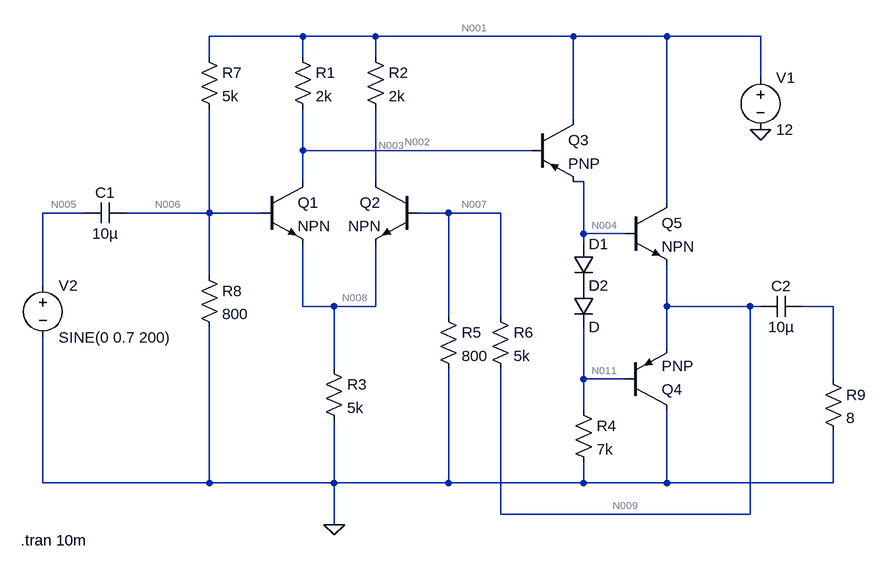
[diagram p0: schematic Last try.asc]
Last try.asc, the LTspice schematic file:
Version 4
SHEET 1 1032 680
WIRE 160 -112 16 -112
WIRE 272 -112 160 -112
WIRE 576 -112 272 -112
WIRE 720 -112 576 -112
WIRE 864 -112 720 -112
WIRE 16 -80 16 -112
WIRE 160 -80 160 -112
WIRE 272 -80 272 -112
WIRE 864 -48 864 -112
WIRE 576 16 576 -112
WIRE 160 64 160 0
WIRE 512 64 160 64
WIRE 160 112 160 64
WIRE 272 112 272 0
WIRE 592 112 576 112
WIRE 720 144 720 -112
WIRE -176 160 -240 160
WIRE 16 160 16 0
WIRE 16 160 -112 160
WIRE 96 160 16 160
WIRE 384 160 336 160
WIRE 464 160 384 160
WIRE 592 192 592 112
WIRE 656 192 592 192
WIRE 592 208 592 192
WIRE 16 256 16 160
WIRE -240 272 -240 160
WIRE 160 304 160 208
WIRE 208 304 160 304
WIRE 272 304 272 208
WIRE 272 304 208 304
WIRE 720 304 720 240
WIRE 848 304 720 304
WIRE 864 304 848 304
WIRE 976 304 928 304
WIRE 384 320 384 160
WIRE 464 320 464 160
WIRE 720 368 720 304
WIRE 208 400 208 304
WIRE 592 416 592 336
WIRE 656 416 592 416
WIRE 976 416 976 304
WIRE 592 464 592 416
WIRE -240 576 -240 352
WIRE 16 576 16 336
WIRE 16 576 -240 576
WIRE 208 576 208 480
WIRE 208 576 16 576
WIRE 384 576 384 400
WIRE 384 576 208 576
WIRE 592 576 592 544
WIRE 592 576 384 576
WIRE 720 576 720 464
WIRE 720 576 592 576
WIRE 976 576 976 496
WIRE 976 576 720 576
WIRE 464 624 464 400
WIRE 848 624 848 304
WIRE 848 624 464 624
WIRE 208 640 208 576
FLAG 208 640 0
FLAG 864 32 0
SYMBOL npn 336 112 M0
SYMATTR InstName Q2
SYMBOL pnp 512 16 R0
SYMATTR InstName Q3
SYMBOL pnp 656 464 M180
SYMATTR InstName Q4
SYMBOL npn 656 144 R0
SYMATTR InstName Q5
SYMBOL res 144 -96 R0
SYMATTR InstName R1
SYMATTR Value 2k
SYMBOL res 256 -96 R0
SYMATTR InstName R2
SYMATTR Value 2k
SYMBOL res 192 384 R0
SYMATTR InstName R3
SYMATTR Value 5k
SYMBOL diode 576 208 R0
SYMATTR InstName D1
SYMBOL diode 576 272 R0
SYMATTR InstName D2
SYMBOL res 576 448 R0
SYMATTR InstName R4
SYMATTR Value 7k
SYMBOL res 368 304 R0
SYMATTR InstName R5
SYMATTR Value 800
SYMBOL res 448 304 R0
SYMATTR InstName R6
SYMATTR Value 5k
SYMBOL res 0 -96 R0
SYMATTR InstName R7
SYMATTR Value 5k
SYMBOL res 0 240 R0
SYMATTR InstName R8
SYMATTR Value 800
SYMBOL cap -112 144 R90
WINDOW 0 0 32 VBottom 2
WINDOW 3 32 32 VTop 2
SYMATTR InstName C1
SYMATTR Value 10µ
SYMBOL cap 928 288 R90
WINDOW 0 0 32 VBottom 2
WINDOW 3 32 32 VTop 2
SYMATTR InstName C2
SYMATTR Value 10µ
SYMBOL voltage -240 256 R0
WINDOW 123 0 0 Left 0
WINDOW 39 0 0 Left 0
SYMATTR InstName V2
SYMATTR Value SINE(0 0.7 200)
SYMBOL res 960 400 R0
SYMATTR InstName R9
SYMATTR Value 8
SYMBOL voltage 864 -64 R0
WINDOW 123 0 0 Left 0
WINDOW 39 0 0 Left 0
SYMATTR InstName V1
SYMATTR Value 12
SYMBOL npn 96 112 R0
SYMATTR InstName Q1
TEXT -274 664 Left 2 !.tran 10m

The netlist it stands for:
* Last try.asc
Q2 N003 N007 N008 0 NPN
Q3 N001 N002 N004 0 PNP
Q4 0 N011 N009 0 PNP
Q5 N001 N004 N009 0 NPN
R1 N001 N002 2k
R2 N001 N003 2k
R3 N008 0 5k
D1 N004 P001 D
D2 P001 N011 D
R4 N011 0 7k
R5 N007 0 800
R6 N007 N009 5k
R7 N001 N006 5k
R8 N006 0 800
C1 N006 N005 10µ
C2 N010 N009 10µ
V2 N005 0 SINE(0 0.7 200)
R9 N010 0 8
V1 N001 0 12
Q1 N002 N006 N008 0 NPN
.model D D
.lib standard.dio
.model NPN NPN
.model PNP PNP
.lib standard.bjt
.tran 10m
.backanno
.end

* Results of the author's LTspice run, read from the files saved beside the schematic
* Operating Point, zero values left out:
*   V(n003) = 12 V
*   V(n007) = 6.019 µV
*   V(n008) = 923.6 mV
*   V(n001) = 12 V
*   V(n002) = 11.63 V
*   V(n004) = 468.8 mV
*   V(n011) = 605.7 nV
*   V(n009) = 43.57 µV
*   V(p001) = 234.4 mV
*   V(n006) = 1.654 V
*   Ic(Q3) = 277.7 pA
*   Ib(Q3) = -127.9 pA
*   Ie(Q3) = -149.8 pA
*   Ic(Q1) = 182.9 µA
*   Ib(Q1) = 1.829 µA
*   Ie(Q1) = -184.7 µA
*   Ic(Q5) = 7.447 nA
*   Ib(Q5) = 63.29 pA
*   Ie(Q5) = -7.51 nA
*   Ic(Q2) = 12 pA
*   Ib(Q2) = -12.92 pA
*   I(D2) = 86.52 pA
*   I(D1) = 86.52 pA
*   I(R8) = 2.067 mA
*   I(R7) = 2.069 mA
*   I(R6) = -7.51 nA
*   I(R5) = 7.523 nA
*   I(R4) = 86.52 pA
*   I(R3) = 184.7 µA
*   I(R2) = 12 pA
*   I(R1) = 182.9 µA
*   I(V1) = -2.252 mA
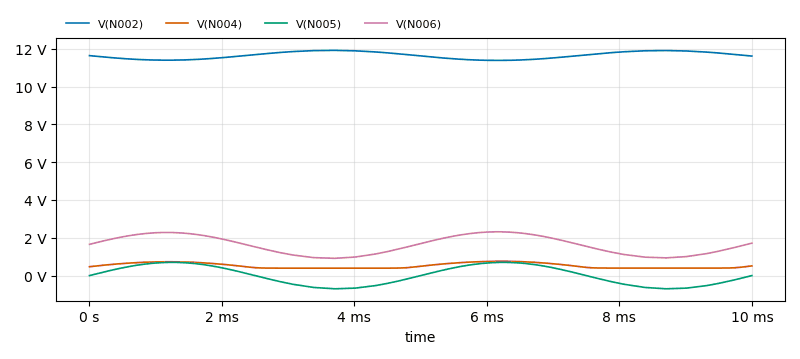
[diagram p1: Transient Analysis of Last try.asc, plotted from the saved traces]
* Transient Analysis, 1 run:
*   V(N002): min 11.38 V, max 11.91 V, average 11.65 V, rms 11.65 V, last 11.61 V
*   V(N004): min 392.7 mV, max 756.2 mV, average 522 mV, rms 539.6 mV, last 512.5 mV
*   V(N005): min -698.8 mV, max 700 mV, average 2.222 mV, rms 493.3 mV, last 0 V
*   V(N006): min 913.1 mV, max 2.317 V, average 1.614 V, rms 1.685 V, last 1.715 V